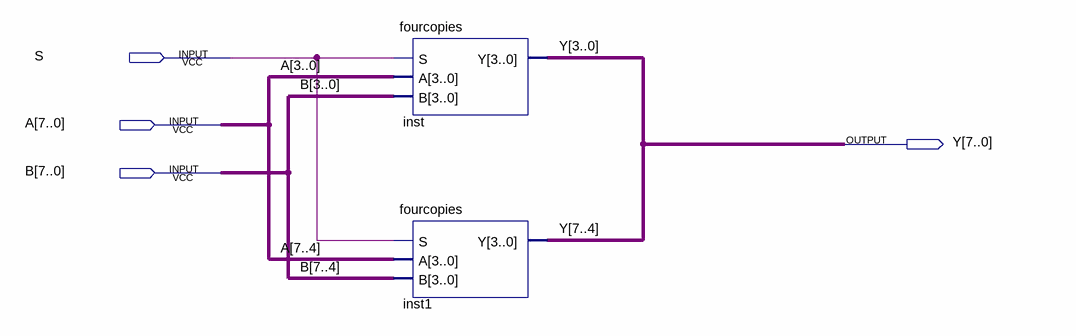
[diagram p0: schematic sheet]
// Quartus schematic eightmutilpexer.bdf as structural Verilog: 2 symbols, 4 pins
module eightmutilpexer (
  input  S,
  input  [7:0] A,
  input  [7:0] B,
  output [7:0] Y
);

  fourcopies inst (.S(S), .A(A[3:0]), .B(B[3:0]), .Y(Y[3:0]));
  fourcopies inst1 (.S(S), .A(A[7:4]), .B(B[7:4]), .Y(Y[7:4]));
endmodule
